# EAGLE design Desain_PCB (Mainboard) (EAGLE 9.6.2)
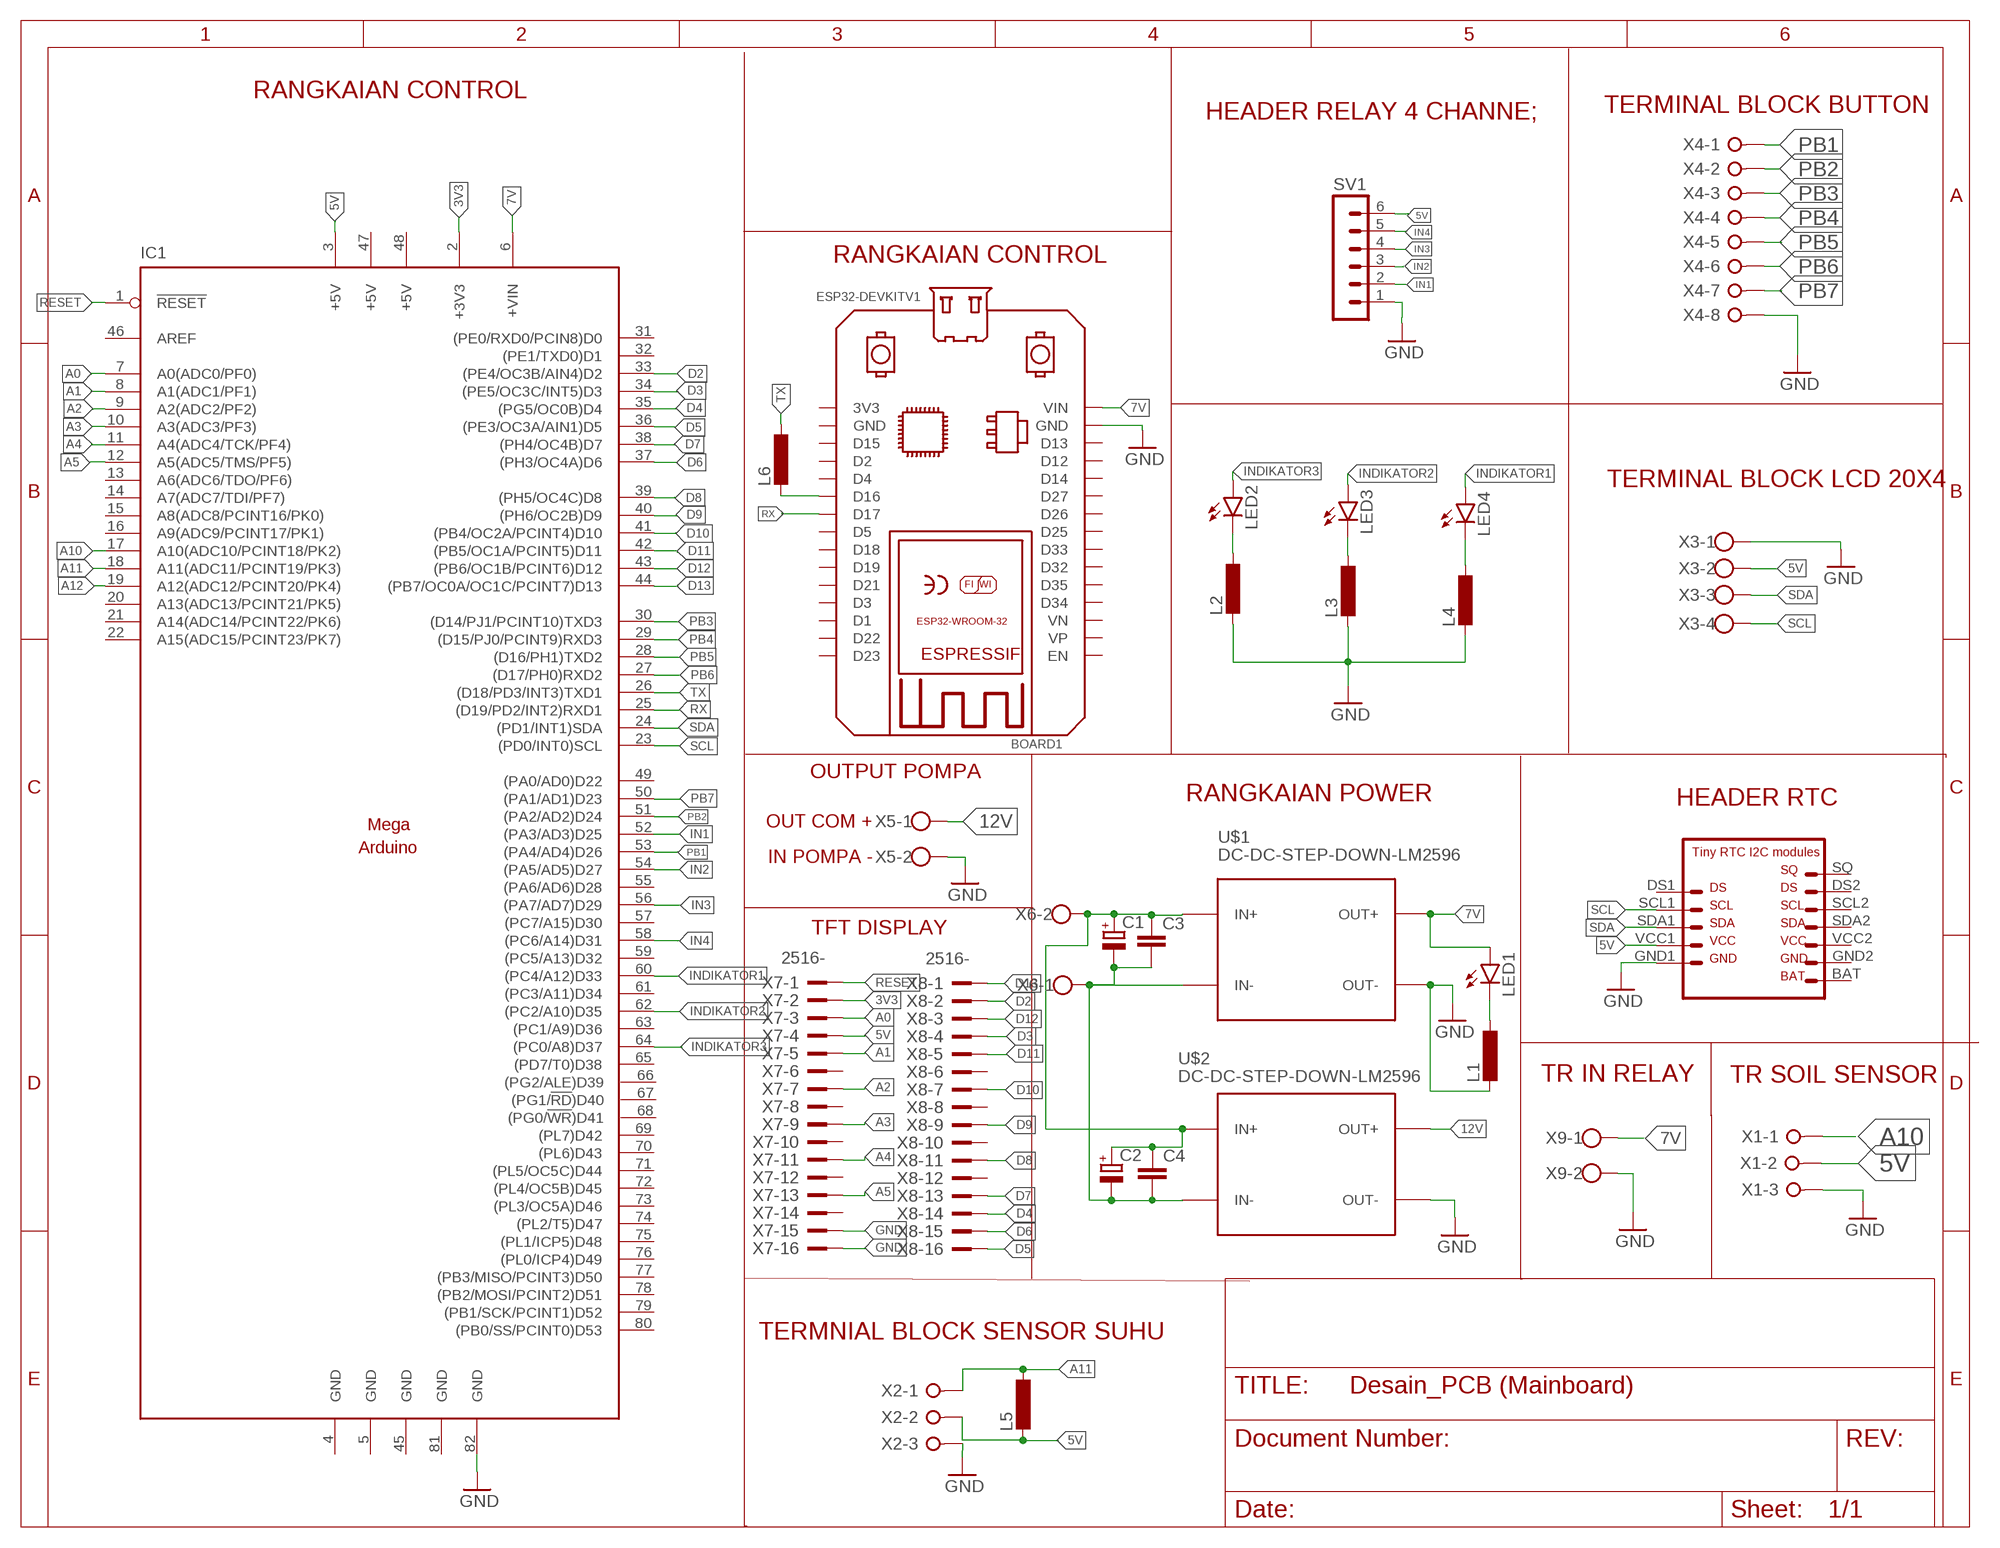
[diagram p0: schematic, sheet 1]

## Parts
BOARD1  ESP32DEVKITV1  [ESP32-DEVKITV1]
C1  CPOL-EUE2,5-6E  [E2,5-6E]
C2  CPOL-EUE2,5-6E  [E2,5-6E]
C3  C-EU025-025X050  [C025-025X050]
C4  C-EU025-025X050  [C025-025X050]
IC1  ARDUINOMEGA  [ARDUINOMEGA]
L1  L-EU0207/10  [0207/10]
L2  L-EU0207/10  [0207/10]
L3  L-EU0207/10  [0207/10]
L4  L-EU0207/10  [0207/10]
L5  L-EU0207/10  [0207/10]
L6  L-EU0207/10  [0207/10]
LED1  LED5MM  [LED5MM]
LED2  LED5MM  [LED5MM]
LED3  LED5MM  [LED5MM]
LED4  LED5MM  [LED5MM]
SV1  MA06-1  [MA06-1]
U$1  DC-DC-STEP-DOWN-LM2596  [DC-DC-STEP-DOWN-LM2596]
U$2  DC-DC-STEP-DOWN-LM2596  [DC-DC-STEP-DOWN-LM2596]
U$3  RTC  [RTC]
X1  W237-3E  [W237-3E]
X2  W237-3E  [W237-3E]
X3  W237-4  [W237-4]
X4  W237-08P  [W237-8P]
X5  W237-102  [W237-102]
X6  W237-102  [W237-102]
X7  2516-  [PAK100/2500-16]
X8  2516-  [PAK100/2500-16]
X9  W237-102  [W237-102]

## Nets
3V3: IC1.2(+3V3) X7.2
5V: IC1.3(+5V) L5.2 SV1.6 U$3.VCC1 X1.2 X2.2 X3.2 X7.4
7V: BOARD1.VIN IC1.6(+VIN) LED1.A U$1.OUT+ X9.1
12V: U$2.OUT+ X5.1
A0: IC1.7(A0(ADC0/PF0)) X7.3
A1: IC1.8(A1(ADC1/PF1)) X7.5
A2: IC1.9(A2(ADC2/PF2)) X7.7
A3: IC1.10(A3(ADC3/PF3)) X7.9
A4: IC1.11(A4(ADC4/TCK/PF4)) X7.11
A5: IC1.12(A5(ADC5/TMS/PF5)) X7.13
A10: IC1.17(A10(ADC10/PCINT18/PK2)) X1.1
A11: IC1.18(A11(ADC11/PCINT19/PK3)) L5.1 X2.1
A12: IC1.19(A12(ADC12/PCINT20/PK4))
D2: IC1.33((PE4/OC3B/AIN4)D2) X8.2
D3: IC1.34((PE5/OC3C/INT5)D3) X8.4
D4: IC1.35((PG5/OC0B)D4) X8.14
D5: IC1.36((PE3/OC3A/AIN1)D5) X8.16
D6: IC1.37((PH3/OC4A)D6) X8.15
D7: IC1.38((PH4/OC4B)D7) X8.13
D8: IC1.39((PH5/OC4C)D8) X8.11
D9: IC1.40((PH6/OC2B)D9) X8.9
D10: IC1.41((PB4/OC2A/PCINT4)D10) X8.7
D11: IC1.42((PB5/OC1A/PCINT5)D11) X8.5
D12: IC1.43((PB6/OC1B/PCINT6)D12) X8.3
D13: IC1.44((PB7/OC0A/OC1C/PCINT7)D13) X8.1
GND: BOARD1.GND IC1.82(GND) L1.2 L2.2 L3.2 L4.2 SV1.1 U$1.OUT- U$2.OUT- U$3.GND1 X1.3 X2.3 X3.1 X4.8 X5.2 X7.15 X7.16 X9.2
IN1: IC1.52((PA3/AD3)D25) SV1.2
IN2: IC1.54((PA5/AD5)D27) SV1.3
IN3: IC1.56((PA7/AD7)D29) SV1.4
IN4: IC1.58((PC6/A14)D31) SV1.5
INDIKATOR1: IC1.60((PC4/A12)D33) LED4.A
INDIKATOR2: IC1.62((PC2/A10)D35) LED3.A
INDIKATOR3: IC1.64((PC0/A8)D37) LED2.A
N$2: C1.- C2.- C3.2 C4.2 U$1.IN- U$2.IN- X6.1
N$3: L1.1 LED1.K(C)
N$4: BOARD1.D16 L6.2
N$6: L2.1 LED2.K(C)
N$8: L3.1 LED3.K(C)
N$10: L4.1 LED4.K(C)
N$79: C1.+ C2.+ C3.1 C4.1 U$1.IN+ U$2.IN+ X6.2
PB1: IC1.53((PA4/AD4)D26) X4.1
PB2: IC1.51((PA2/AD2)D24) X4.2
PB3: IC1.30((D14/PJ1/PCINT10)TXD3) X4.3
PB4: IC1.29((D15/PJ0/PCINT9)RXD3) X4.4
PB5: IC1.28((D16/PH1)TXD2) X4.5
PB6: IC1.27((D17/PH0)RXD2) X4.6
PB7: IC1.50((PA1/AD1)D23) X4.7
RESET: IC1.1(!RESET) X7.1
RX: BOARD1.D17 IC1.25((D19/PD2/INT2)RXD1)
SCL: IC1.23((PD0/INT0)SCL) U$3.SCL1 X3.4
SDA: IC1.24((PD1/INT1)SDA) U$3.SDA1 X3.3
TX: IC1.26((D18/PD3/INT3)TXD1) L6.1
Unconnected: BOARD1.3V3 BOARD1.D1 BOARD1.D2 BOARD1.D3 BOARD1.D4 BOARD1.D5 BOARD1.D12 BOARD1.D13 BOARD1.D14 BOARD1.D15 BOARD1.D18 BOARD1.D19 BOARD1.D21 BOARD1.D22 BOARD1.D23 BOARD1.D25 BOARD1.D26 BOARD1.D27 BOARD1.D32 BOARD1.D33 BOARD1.D34 BOARD1.D35 BOARD1.EN BOARD1.GND@1(GND) BOARD1.VN BOARD1.VP IC1.13(A6(ADC6/TDO/PF6)) IC1.14(A7(ADC7/TDI/PF7)) IC1.15(A8(ADC8/PCINT16/PK0)) IC1.16(A9(ADC9/PCINT17/PK1)) IC1.20(A13(ADC13/PCINT21/PK5)) IC1.21(A14(ADC14/PCINT22/PK6)) IC1.22(A15(ADC15/PCINT23/PK7)) IC1.31((PE0/RXD0/PCIN8)D0) IC1.32((PE1/TXD0)D1) IC1.46(AREF) IC1.49((PA0/AD0)D22) IC1.55((PA6/AD6)D28) IC1.57((PC7/A15)D30) IC1.59((PC5/A13)D32) IC1.61((PC3/A11)D34) IC1.63((PC1/A9)D36) IC1.65((PD7/T0)D38) IC1.66((PG2/ALE)D39) IC1.67((PG1/!RD!)D40) IC1.68((PG0/!WR!)D41) IC1.69((PL7)D42) IC1.70((PL6)D43) IC1.71((PL5/OC5C)D44) IC1.72((PL4/OC5B)D45) IC1.73((PL3/OC5A)D46) IC1.74((PL2/T5)D47) IC1.75((PL1/ICP5)D48) IC1.76((PL0/ICP4)D49) IC1.77((PB3/MISO/PCINT3)D50) IC1.78((PB2/MOSI/PCINT2)D51) IC1.79((PB1/SCK/PCINT1)D52) IC1.80((PB0/SS/PCINT0)D53) U$3.BAT U$3.DS1 U$3.DS2 U$3.GND2 U$3.SCL2 U$3.SDA2 U$3.SQ U$3.VCC2 X7.6 X7.8 X7.10 X7.12 X7.14 X8.6 X8.8 X8.10 X8.12

## Notes on the sheet
- RANGKAIAN CONTROL
- HEADER RELAY 4 CHANNE; | TERMINAL BLOCK BUTTON
- RANGKAIAN CONTROL
- TERMINAL BLOCK LCD 20X4
- OUTPUT POMPA
- RANGKAIAN POWER | HEADER RTC
- OUT COM +
- IN POMPA -
- TFT DISPLAY
- TR IN RELAY | TR SOIL SENSOR
- TERMNIAL BLOCK SENSOR SUHU

## Power pins joined to a net without a drawn wire
+5V: IC1.47(+5V) IC1.48(+5V)
GND: IC1.4(GND) IC1.5(GND) IC1.45(GND) IC1.81(GND)

## Library data of the parts
BOARD1 = ESP32-DEVKITV1:ESP32DEVKITV1: https://github.com/shridattdudhat
C1 C2 = CAPACITOR:CPOL-EU: POLARIZED CAPACITOR, European symbol; SPICEPREFIX: C
C3 C4 = CAPACITOR:C-EU: CAPACITOR, European symbol; SPICEPREFIX: C
IC1 = microcontroller:ARDUINOMEGA: The Arduino Mega is a microcontroller board based on the ATmega1280. - 54 digital input/output pins (of which 14 can be used as PWM outputs) - 16 analog inputs - 4 UARTs (hardware serial ports) - 16 MHz crystal oscillator - USB connection - power jack - ICSP header - reset button It contains everything needed to support the microcontroller; simply connect it to a computer with a USB cable or power it with a AC-to-DC adapter or battery to get started. The Mega is compatible with most shields designed for the Arduino Duemilanove or Diecimila. http://arduino.cc/en/Main/ArduinoBoardMega
L1-L6 = rcl:L-EU: INDUCTOR, European symbol; SPICEPREFIX: L
LED1-LED4 = led:LED: LED OSRAM: - CHIPLED LG R971, LG N971, LY N971, LG Q971, LY Q971, LO R971, LY R971 LH N974, LH R974 LS Q976, LO Q976, LY Q976 LO Q996 - Hyper CHIPLED LW Q18S LB Q993, LB Q99A, LB R99A - SideLED LS A670, LO A670, LY A670, LG A670, LP A670 LB A673, LV A673, LT A673, LW A673 LH A674 LY A675 LS A676, LA A676, LO A676, LY A676, LW A676 LS A679, LY A679, LG A679 - Hyper Micro SIDELED® LS Y876, LA Y876, LO Y876, LY Y876 LT Y87S - SmartLED LW L88C, LW L88S LB L89C, LB L89S, LG L890 LS L89K, LO L89K, LY L89K LS L896, LA L896, LO L896, LY L896 - TOPLED LS T670, LO T670, LY T670, LG T670, LP T670 LSG T670, LSP T670, LSY T670, LOP T670, LYG T670 LG T671, LOG T671, LSG T671 LB T673, LV T673, LT T673, LW T673 LH T674 LS T676, LA T676, LO T676, LY T676, LB T676, LH T676, LSB T676, LW T676 LB T67C, LV T67C, LT T67C, LS T67K, LO T67K, LY T67K, LW E67C LS E67B, LA E67B, LO E67B, LY E67B, LB E67C, LV E67C, LT E67C LW T67C LS T679, LY T679, LG T679 LS T770, LO T770, LY T770, LG T770, LP T770 LB T773, LV T773, LT T773, LW T773 LH T774 LS E675, LA E675, LY E675, LS T675 LS T776, LA T776, LO T776, LY T776, LB T776 LHGB T686 LT T68C, LB T68C - Hyper Mini TOPLED® LB M676 - Mini TOPLED Santana® LG M470 LS M47K, LO M47K, LY M47K Source: http://www.osram.convergy.de LUXEON: - LUMILED® LXK2-PW12-R00, LXK2-PW12-S00, LXK2-PW14-U00, LXK2-PW14-V00 LXK2-PM12-R00, LXK2-PM12-S00, LXK2-PM14-U00 LXK2-PE12-Q00, LXK2-PE12-R00, LXK2-PE12-S00, LXK2-PE14-T00, LXK2-PE14-U00 LXK2-PB12-K00, LXK2-PB12-L00, LXK2-PB12-M00, LXK2-PB14-N00, LXK2-PB14-P00, LXK2-PB14-Q00 LXK2-PR12-L00, LXK2-PR12-M00, LXK2-PR14-Q00, LXK2-PR14-R00 LXK2-PD12-Q00, LXK2-PD12-R00, LXK2-PD12-S00 LXK2-PH12-R00, LXK2-PH12-S00 LXK2-PL12-P00, LXK2-PL12-Q00, LXK2-PL12-R00 Source: www.luxeon.com KINGBRIGHT: KA-3528ASYC Source: www.kingbright.com
SV1 = con-lstb:MA06-1: PIN HEADER; OC_FARNELL: unknown; OC_NEWARK: unknown
U$1 U$2 = diy-modules:DC-DC-STEP-DOWN-LM2596: DC/DC Step-Down Regulator based on LM2596-ADJ chip
U$3 = RTC:RTC
X1 X2 = con-wago-508:W237-3E: WAGO SREW CLAMP; OC_FARNELL: unknown; OC_NEWARK: unknown
X3 = con-wago-500:W237-4: WAGO SCREW CLAMP; OC_FARNELL: unknown; OC_NEWARK: unknown
X4 = con-wago-508:W237-08P: WAGO SREW CLAMP; OC_FARNELL: unknown; OC_NEWARK: unknown
X5 X6 X9 = con-wago-500:W237-102: WAGO SCREW CLAMP; MPN: 237-102; OC_FARNELL: unknown; OC_NEWARK: 70K9898
X7 X8 = con-3m:2516-: 3M (TM) Pak 100 4-Wall Header Source: 3M; OC_FARNELL: unknown; OC_NEWARK: unknown

## Board
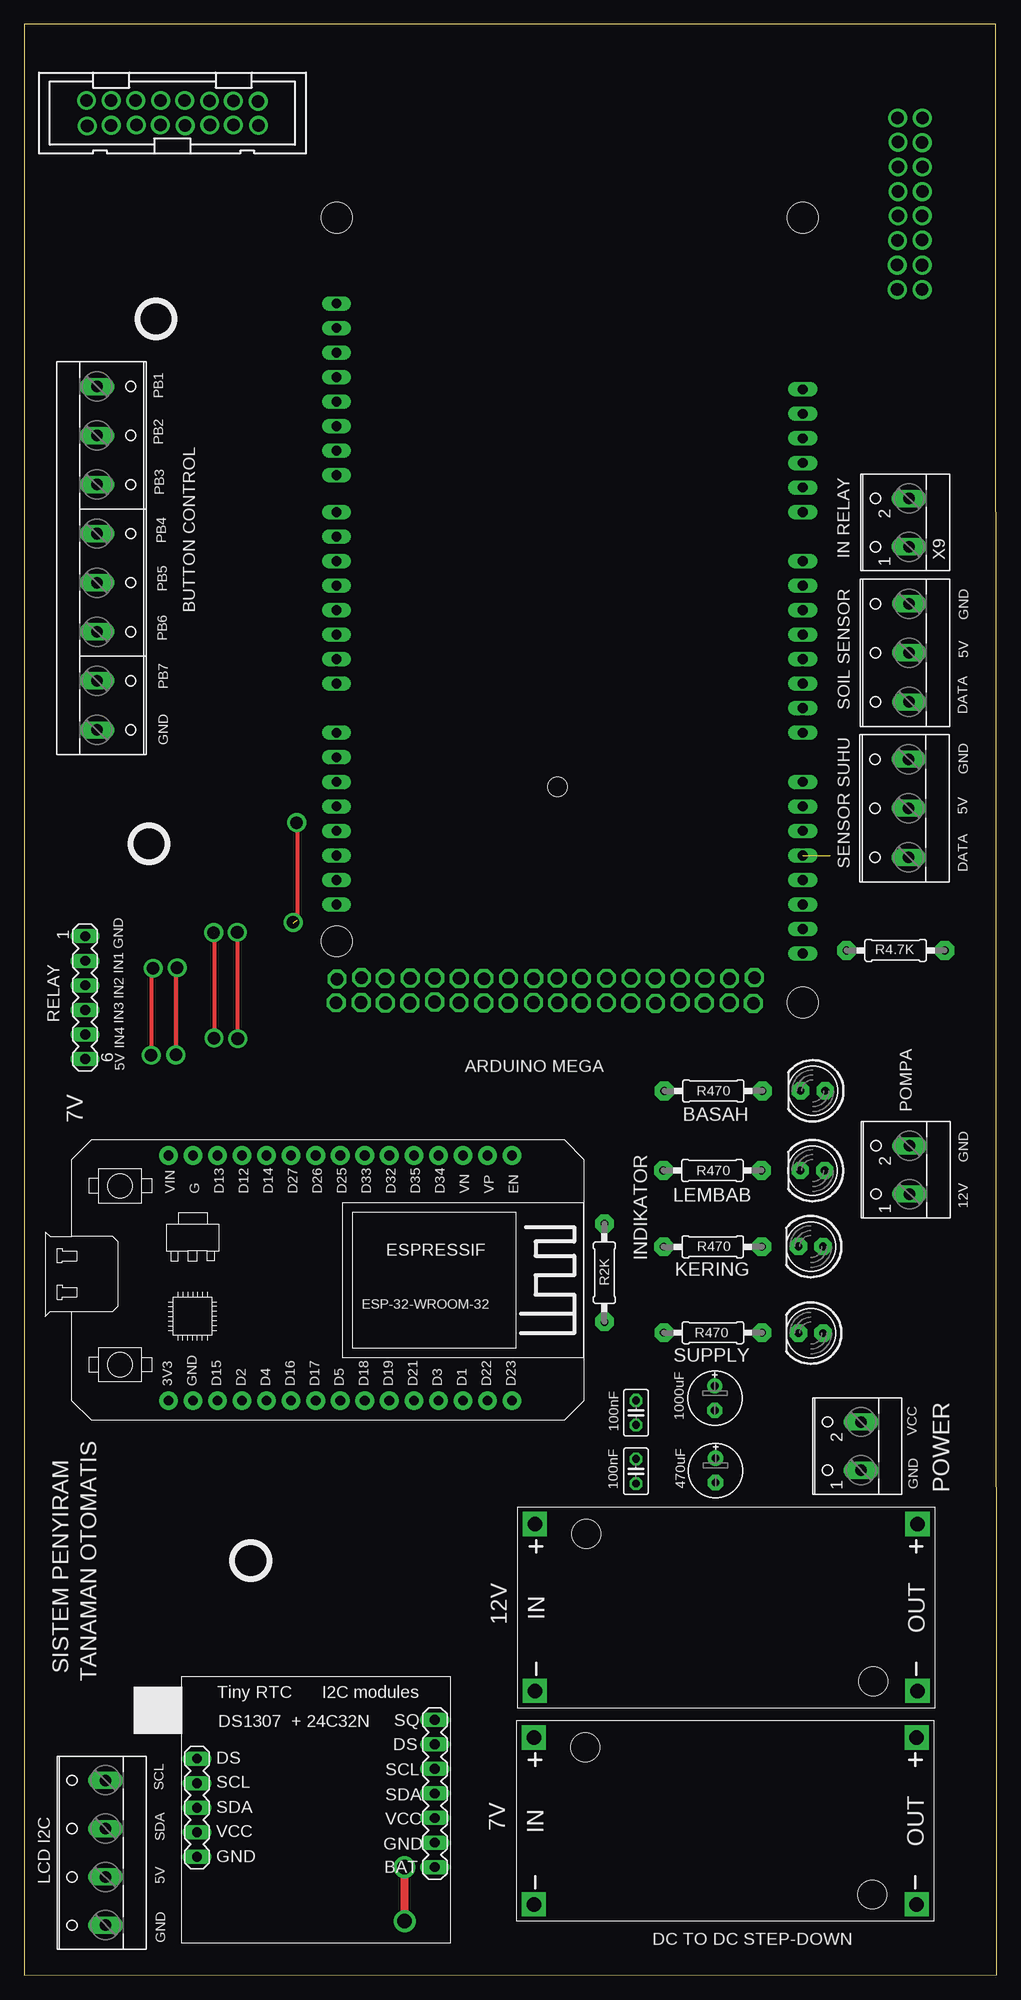
[diagram p1: board, top side]
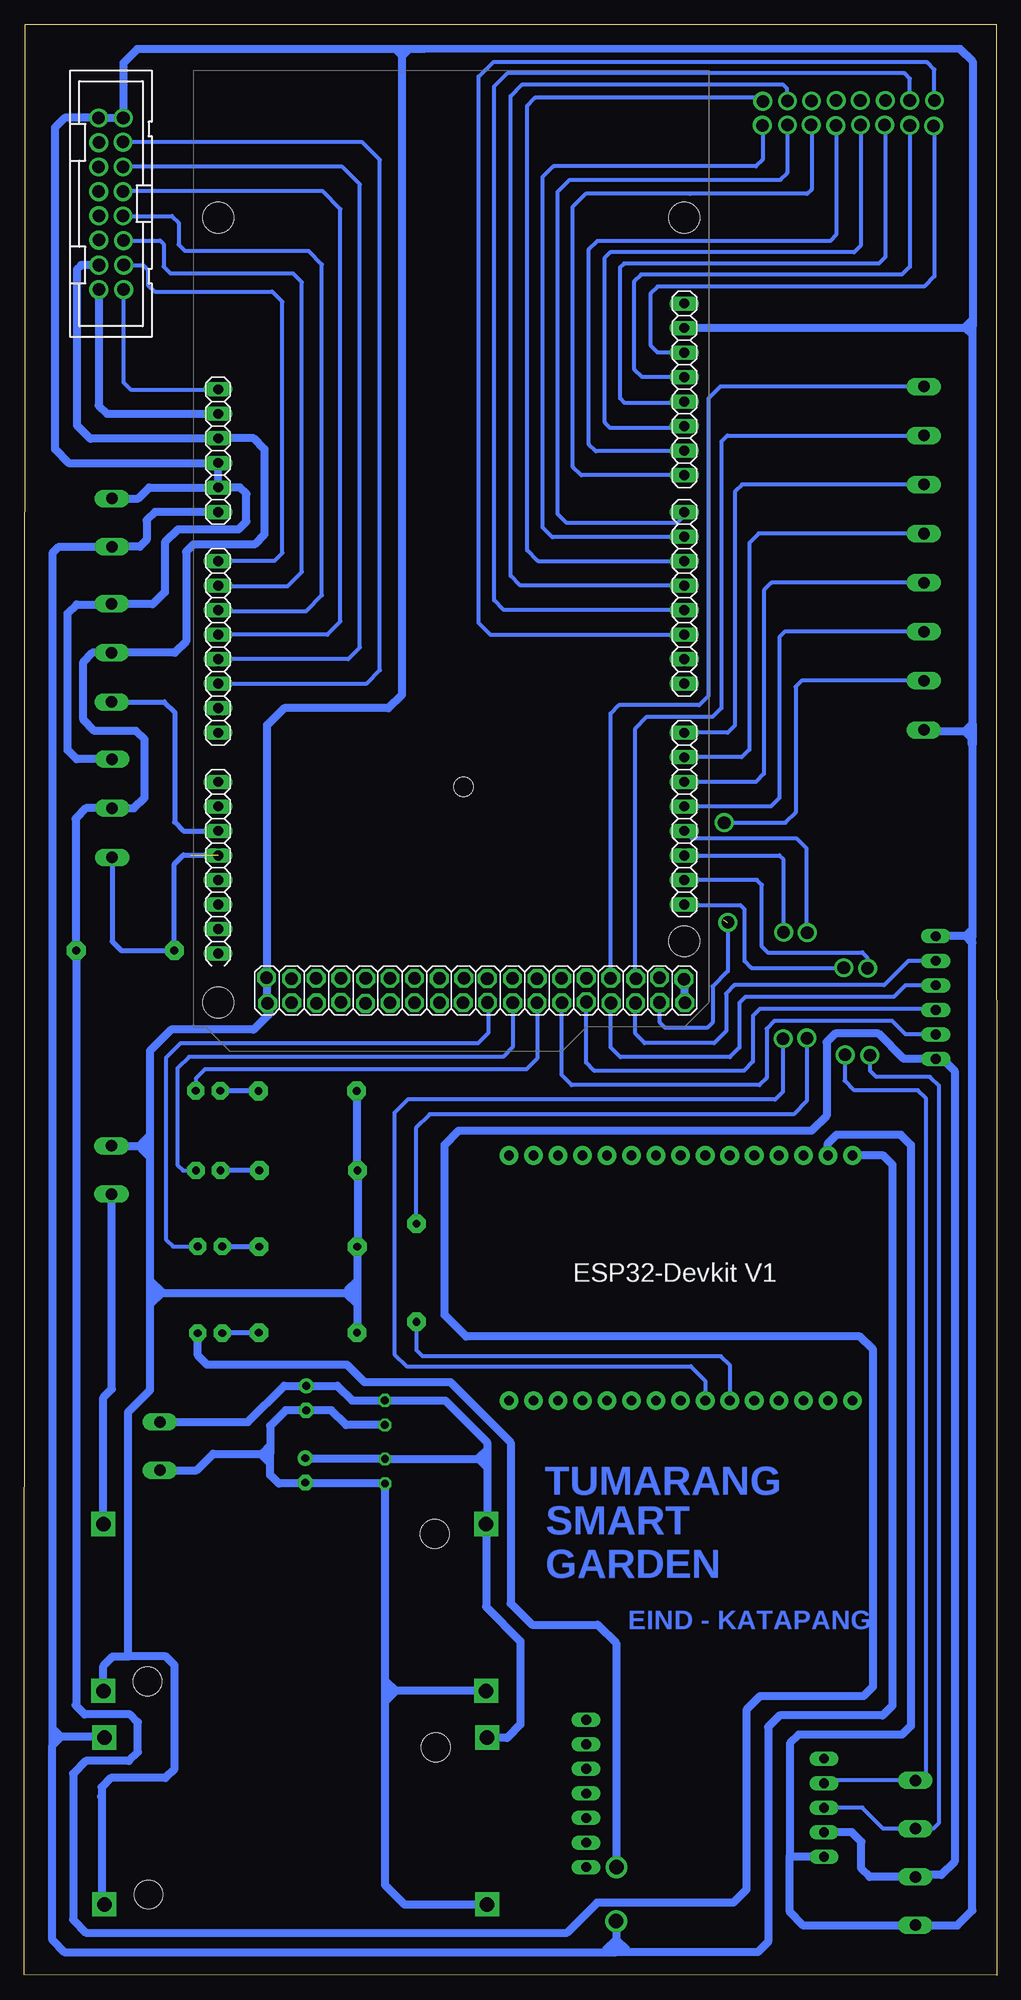
[diagram p2: board, bottom side, seen from below]

Size 100.68 x 202.03 mm. Coordinates in mm from the lower left corner, seen from the top.
Outline: 0,0 100.68,0.06 100.59,202.03 0.03,202.02 0,0
Copper layers (1*16): Top 0.035mm / dielectric 1.5mm / Bottom 0.035mm
Design rules "default *": minimum track width 6mil, minimum drill 0.35mm, track to track 16mil, track to pad 16mil, pad to pad 16mil, via to via 16mil, smd to smd 6mil, copper to edge 24mil, drill to drill 6mil, minimum pad ring 10mil, minimum via ring 8mil, stop-mask expansion 4mil, vias tented up to drill 0mil, thermal gap 10mil

### Footprints (pad centres in the part's own frame; a part is rotated, then mirrored left to right if it is on the bottom)
ESP32-DEVKITV1 = drill 1 pad 1.93: 3V3 0,0; D1 30.48,0; D2 7.62,0; D3 27.94,0; D4 10.16,0; D5 17.78,0; D12 7.62,25.4; D13 5.08,25.4; D14 10.16,25.4; D15 5.08,0; D16 12.7,0; D17 15.24,0; D18 20.32,0; D19 22.86,0; D21 25.4,0; D22 33.02,0; D23 35.56,0; D25 17.78,25.4; D26 15.24,25.4; D27 12.7,25.4; D32 22.86,25.4; D33 20.32,25.4; D34 27.94,25.4; D35 25.4,25.4; EN 35.56,25.4; GND 2.54,25.4; GND@1 2.54,0; VIN 0,25.4; VN 30.48,25.4; VP 33.02,25.4
E2,5-6E = drill 0.813 pad 1.575: + -1.27,0 | drill 0.813 pad 1.575 octagon: - 1.27,0
C025-025X050 = drill 0.813 octagon: 1 -1.27,0; 2 1.27,0
ARDUINOMEGA = drill 1.016 long: 1 33.02,2.54; 2 35.56,2.54; 3 38.1,2.54; 4 40.64,2.54; 5 43.18,2.54; 6 45.72,2.54; 7 50.8,2.54; 8 53.34,2.54; 9 55.88,2.54; 10 58.42,2.54; 11 60.96,2.54; 12 63.5,2.54; 13 66.04,2.54; 14 68.58,2.54; 15 73.66,2.54; 16 76.2,2.54; 17 78.74,2.54; 18 81.28,2.54; 19 83.82,2.54; 20 86.36,2.54; 21 88.9,2.54; 22 91.44,2.54; 23 86.36,50.8; 24 83.82,50.8; 25 81.28,50.8; 26 78.74,50.8; 27 76.2,50.8; 28 73.66,50.8; 29 71.12,50.8; 30 68.58,50.8; 31 63.5,50.8; 32 60.96,50.8; 33 58.42,50.8; 34 55.88,50.8; 35 53.34,50.8; 36 50.8,50.8; 37 48.26,50.8; 38 45.72,50.8; 39 41.91,50.8; 40 39.37,50.8; 41 36.83,50.8; 42 34.29,50.8; 43 31.75,50.8; 44 29.21,50.8; 45 26.67,50.8; 46 24.13,50.8 | drill 1.016 octagon: 47 93.98,50.8; 48 96.52,50.8; 49 93.98,48.26; 50 96.52,48.26; 51 93.98,45.72; 52 96.52,45.72; 53 93.98,43.18; 54 96.52,43.18; 55 93.98,40.64; 56 96.52,40.64; 57 93.98,38.1; 58 96.52,38.1; 59 93.98,35.56; 60 96.52,35.56; 61 93.98,33.02; 62 96.52,33.02; 63 93.98,30.48; 64 96.52,30.48; 65 93.98,27.94; 66 96.52,27.94; 67 93.98,25.4; 68 96.52,25.4; 69 93.98,22.86; 70 96.52,22.86; 71 93.98,20.32; 72 96.52,20.32; 73 93.98,17.78; 74 96.52,17.78; 75 93.98,15.24; 76 96.52,15.24; 77 93.98,12.7; 78 96.52,12.7; 79 93.98,10.16; 80 96.52,10.16; 81 93.98,7.62; 82 96.52,7.62 | hole 3.2: 15.24,50.8; 15.24,2.54; 90.17,50.8; 96.52,2.54 | hole 2: 74.168,27.94
0207/10 = drill 0.813 pad 1.93 octagon: 1 -5.08,0; 2 5.08,0
LED5MM = drill 0.813 pad 1.778 octagon: A -1.27,0; K 1.27,0
MA06-1 = drill 1.016 long: 1 -6.35,0; 2 -3.81,0; 3 -1.27,0; 4 1.27,0; 5 3.81,0; 6 6.35,0
DC-DC-STEP-DOWN-LM2596 = drill 1.5 pad 2.5 square: IN+ -19.812,8.636; IN- -19.812,-8.636; OUT+ 19.812,8.636; OUT- 19.812,-8.636 | hole 3: -14.478,7.62; 15.24,-7.62
RTC = drill 1.016 long: BAT 25.75,7.82; DS1 1.13,19.05; DS2 25.75,20.52; GND1 1.13,8.89; GND2 25.75,10.36; SCL1 1.13,16.51; SCL2 25.75,17.98; SDA1 1.13,13.97; SDA2 25.75,15.44; SQ 25.75,23.06; VCC1 1.13,11.43; VCC2 25.75,12.9
W237-3E = drill 1.194 long: 1 -5.08,-0.635; 2 0,-0.635; 3 5.08,-0.635
W237-4 = drill 1.194 long: 1 -7.5,-1.27; 2 -2.5,-1.27; 3 2.5,-1.27; 4 7.5,-1.27
W237-8P = drill 1.194 long: 1 -17.78,-0.635; 2 -12.7,-0.635; 3 -7.62,-0.635; 4 -2.54,-0.635; 5 2.54,-0.635; 6 7.62,-0.635; 7 12.7,-0.635; 8 17.78,-0.635
W237-102 = drill 1.194 long: 1 -2.5,-1.27; 2 2.5,-1.27
PAK100/2500-16 = drill 1 pad 1.422: 1 -8.89,-1.27; 2 -8.89,1.27; 3 -6.35,-1.27; 4 -6.35,1.27; 5 -3.81,-1.27; 6 -3.81,1.27; 7 -1.27,-1.27; 8 -1.27,1.27; 9 1.27,-1.27; 10 1.27,1.27; 11 3.81,-1.27; 12 3.81,1.27; 13 6.35,-1.27; 14 6.35,1.27; 15 8.89,-1.27; 16 8.89,1.27

### Placement (x,y rotation side)
BOARD1  14.94,59.49 0 top
C1  71.57,52.28 270 top
C2  71.49,59.77 270 top
C3  63.34,58.25 270 top
C4  63.33,52.19 270 top
IC1  83.14,197.24 270 bottom
L1  71.3,66.54 180 top
L2  71.28,75.44 180 top
L3  71.25,83.34 180 top
L4  71.34,91.57 180 top
L5  90.21,106.12 0 top
L6  60.07,72.75 270 top
LED1  81.43,66.5 180 top
LED2  81.43,75.46 180 top
LED3  81.62,83.33 180 top
LED4  81.64,91.59 180 top
SV1  6.31,101.24 270 top
U$1  72.57,15.99 0 top
U$2  72.67,38.08 0 top
U$3  16.76,3.39 0 top
X1  90.98,136.94 90 top
X2  90.93,120.84 90 top
X3  7.16,12.69 90 top
X4  8.19,146.74 270 top
X5  90.38,83.4 90 top
X6  85.37,54.8 90 top
X7  91.69,183.44 90 bottom
X8  15.35,192.82 0 top
X9  90.33,150.42 90 top

### Tracks (layer width: path | path; a pad name or v marks a point on that pad's centre or on a via)
3V3
  Bottom 0.813: X7.2 92.96,162.54 92.1,161.68 IC1.2
5V
  Bottom 0.813: X7.4 94.77,177.09 95.21,176.65 95.21,160.5 93.82,159.11 80.63,159.11 IC1.3 76.92,159.14 75.81,158.03 75.81,149.18 76.83,148.16 83.16,148.16 83.91,147.41 83.91,138.11 85.08,136.94 X1.2 93.61,136.94 94.56,135.99 94.56,130.01 93.41,128.86 89.12,128.86 88.22,127.96 88.22,121.94 89.32,120.84 X2.2 94.29,120.84 95.36,119.77 95.36,106.19 L5.2 95.29,28.03 95.36,27.96 94.41,27.01 89.71,27.01 88.91,26.21 88.91,23.11 89.83,22.19 94.29,22.19 95.61,20.87 95.61,5.76 94.28,4.43 44.48,4.43 41.37,7.54 27.27,7.54 25.93,8.88 25.93,27.49 24.51,28.91 13.81,28.91 12.81,29.91 12.81,64.79 14.17,66.15 54.93,66.15 57.16,68.38 57.16,85.99 55.72,87.43 19.18,87.43 17.61,89 17.61,96.62 16.72,97.51 12.23,97.51 9.62,94.89 SV1.6 5.61,94.89 4.36,93.64 4.36,11.77 5.74,10.39 8.23,10.39 X3.2 13.17,10.19 14.02,11.04 14.02,13.83 15.01,14.82 U$3.VCC1
7V  (via drill 1.5)
  Top 0.813: v39.36,11.2 39.36,5.61 v39.39,5.61
  Bottom 0.813: 80.7,151.42 IC1.6 87.13,151.52 87.99,150.66 87.99,148.64 88.71,147.92 X9.1 97.09,147.92 97.77,147.24 97.77,25.56 | BOARD1.VIN 11.75,84.89 10.81,83.95 10.81,27.91 11.81,26.91 22.49,26.91 23.68,25.72 23.68,3.46 24.73,2.41 38.31,2.41 | 38.31,2.41 39.39,2.41 | 97.77,25.56 97.77,23.84 | v39.39,5.61 39.39,3.71 | 39.39,2.41 39.39,3.71 | 40.51,2.41 96.51,2.41 97.77,3.67 97.77,23.84 | 40.51,2.41 39.39,2.41 | LED1.A 82.7,64.2 81.73,63.23 67.26,63.23 65.45,61.42 56.56,61.42 50.31,55.17 50.31,38.51 48.11,36.31 41.31,36.31 39.41,34.41 39.41,11.25 v39.36,11.2 | 97.77,25.56 96.91,24.7 | 96.91,24.7 97.77,23.84 | U$1.OUT+ 92.45,24.7 96.91,24.7 | 39.39,3.71 38.31,2.63 38.31,2.41 | 39.39,3.71 40.51,2.59 40.51,2.41
12V
  Bottom 0.813: 92.59,47.25 92.48,47.14 U$2.OUT+ 92.48,59.84 91.61,60.71 91.61,80.86 X5.1
+5V
  Bottom 0.813: IC1.47 IC1.48
A0
  Bottom 0.406: IC1.7 74.78,146.44 73.94,147.28 73.94,173.27 75,174.33 87.18,174.33 87.87,175.02 87.87,176.6 88.36,177.09 X7.3
A1
  Bottom 0.406: IC1.8 80.51,143.81 73.43,143.81 71.94,145.3 71.94,175.31 72.87,176.24 85.54,176.24 86.24,176.94 86.24,179.26 86.61,179.63 X7.5
A2
  Bottom 0.406: IC1.9 80.45,141.21 71.53,141.21 69.85,142.89 69.85,177.15 71.27,178.57 84.04,178.57 84.68,179.21 84.68,181.45 85.4,182.17 X7.7
A3
  Bottom 0.406: IC1.10 69.3,138.82 67.94,140.18 67.94,182.89 69.76,184.71 X7.9
A4
  Bottom 0.406: IC1.11 67.14,136.28 65.92,137.5 65.92,185.44 67.73,187.25 X7.11
A5
  Bottom 0.406: IC1.12 80.57,133.71 65.28,133.71 63.86,135.13 63.86,187.99 65.66,189.79 X7.13
A10
  Bottom 0.508: X1.1 86.16,131.86 85.11,130.81 85.11,119.41 84.2,118.5 IC1.17
A11  (1 unrouted)
  Bottom 0.406: 91.48,115.67 X2.1 | 83.5,115.97 83.42,115.97
  Bottom 0.508: X2.1 91.57,107.06 90.61,106.11 L5.1 85.13,115.09 84.21,116.01 80.65,116.01 IC1.18
D2
  Bottom 0.406: X8.2 6.46,197.33 7.21,198.08 52.14,198.08 53.63,196.59 53.63,140.04 52.41,138.82 IC1.33
D3
  Bottom 0.406: X8.4 9,196.4 9.53,196.93 50.69,196.93 52.03,195.59 52.03,142.38 51.01,141.36 IC1.34
D4
  Bottom 0.406: IC1.35 49.31,143.9 50.33,144.92 50.33,194.59 49.17,195.75 22.09,195.75 21.7,195.36 X8.14
D5
  Bottom 0.406: IC1.36 47.51,146.44 48.62,147.55 48.62,193.58 47.81,194.39 24.54,194.39 X8.16
D6
  Bottom 0.406: X8.15 24.24,188.01 24.94,187.31 45.91,187.31 47.01,186.21 47.01,149.91 46.01,148.91 32.41,148.91 IC1.37
D7
  Bottom 0.406: IC1.38 32.34,151.15 33.11,150.38 44.52,150.38 45.46,151.32 45.46,184.66 44.21,185.91 22.4,185.91 21.7,186.61 X8.13
D8
  Bottom 0.406: X8.11 19.16,184.91 19.62,184.45 31.75,184.45 42.57,184.45 43.87,183.15 43.87,156.17 43.01,155.31 32.36,155.31 IC1.39
D9
  Bottom 0.406: X8.9 16.62,180.21 17.25,179.58 41.34,179.58 42.21,178.71 42.21,158.51 41.51,157.81 32.4,157.81 IC1.40
D10
  Bottom 0.406: X8.7 14.08,179.09 14.76,178.41 40.01,178.41 40.57,177.85 40.57,160.77 40.01,160.21 32.54,160.21 IC1.41
D11
  Bottom 0.406: X8.5 11.54,177.91 12.21,177.24 38.58,177.24 38.98,176.84 38.98,163.28 38.51,162.81 32.48,162.81 IC1.42
D12
  Bottom 0.406: X8.3 9,176.91 9.82,176.09 36.82,176.09 37.5,175.41 37.5,166.28 36.71,165.49 IC1.43
D13
  Bottom 0.406: X8.1 6.46,175.91 7.52,174.85 35.11,174.85 35.81,174.15 35.81,168.73 35.11,168.03 IC1.44
GND  (via drill 0.85 pad 1.5)
  Bottom 0.152: 2.51,127.37 2.52,127.38 2.57,127.43
  Bottom 0.813: IC1.5 IC1.4 96.07,156.6 97.48,158.01 97.48,191.35 96.5,192.33 X7.16 X7.15 90.42,198 88.98,199.44 62.21,199.44 | X2.3 95.24,125.92 96.17,126.85 96.17,141.04 95.26,141.95 91.69,141.95 X1.3 91.56,141.96 87.37,141.96 86.11,143.22 86.11,148.38 84.78,149.72 78.51,149.72 77.68,150.54 77.68,153.4 78.34,154.06 IC1.5 | U$2.OUT- 92.48,32.04 91.51,33.01 89.91,33.01 | 66.17,91.48 L4.2 66.26,83.43 L3.2 66.17,75.47 L2.2 66.2,71.91 | BOARD1.GND 17.48,86.14 16.6,87.02 9.92,87.02 8.89,85.99 8.89,25.83 9.81,24.91 20.51,24.91 21.41,24.01 21.41,12.41 | 2.57,127.43 2.57,128.1 | 2.57,128.1 2.57,128.84 3.28,128.84 | 2.51,129.61 2.51,127.37 | 2.51,129.61 2.51,169.81 | 2.51,169.81 2.51,170.73 | X4.8 7.44,128.84 3.31,128.84 | U$3.GND1 21.28,12.28 21.41,12.41 | 60,199.45 60.89,199.45 60.89,199.44 | 60,199.45 59.31,199.45 3.82,199.48 2.51,198.17 2.51,171.41 | 21.41,12.41 21.41,6.56 20.01,5.16 8.46,5.16 X3.1 4.07,5.18 2.53,6.72 2.53,106.91 | 92.66,18.56 92.71,18.51 | 89.91,33.01 86.01,33.01 85.11,32.11 85.11,21.41 86.07,20.45 91.69,20.45 92.66,19.48 92.66,18.56 | 92.66,18.56 92.66,7.63 U$1.OUT- | 2.53,107.59 3.21,107.59 | 3.21,107.59 SV1.1 | 2.53,106.91 2.53,107.59 | 2.51,171.41 2.51,170.73 | 60,199.44 60,199.45 | X9.2 88.89,152.92 87.75,154.06 IC1.5 | 89.91,33.01 89.91,58.33 87.63,60.61 87.63,69.51 | 87.63,69.51 87.63,71.01 | 87.63,71.01 87.63,71.91 | 87.63,71.91 87.63,84.71 | 87.63,84.71 87.63,86.11 | 87.63,86.11 87.63,87.01 | 87.63,87.01 87.63,95.76 85.47,97.92 76.93,97.92 75.31,99.55 75.31,100.51 v75.51,100.71 IC1.82 IC1.81 75.52,129.46 73.78,131.2 62.97,131.2 61.56,132.61 61.56,198.78 | X5.2 88.51,85.9
  Bottom 0.813: 88.51,85.9 87.84,85.9 87.63,86.11 | 87.63,87.01 88.51,86.13 88.51,85.9 | 87.63,84.71 88.51,85.59 88.51,85.9 | 66.2,71.91 66.2,70.61 | 66.2,70.61 66.2,69.51 | 66.2,69.51 66.2,66.56 L1.2 | 66.2,70.61 67.21,70.61 | 67.21,70.61 86.51,70.61 | 86.51,70.61 87.23,70.61 87.63,71.01 | 66.2,71.91 67.21,70.9 67.21,70.61 | 66.2,69.51 67.21,70.52 67.21,70.61 | 87.63,71.91 86.51,70.79 86.51,70.61 | 86.51,70.61 87.61,69.51 87.63,69.51 | 3.21,107.59 2.52,108.28 | 2.52,127.38 2.52,108.28 | 2.52,108.28 2.52,107.6 2.53,107.59 | 2.53,106.91 3.21,107.59 | 2.51,129.61 3.28,128.84 | 3.28,128.84 3.31,128.84 | 2.57,128.1 3.31,128.84 | 2.51,170.73 2.67,170.57 3.27,170.57 | 3.35,170.57 IC1.45 | 2.51,171.41 3.35,170.57 | 2.51,169.81 3.27,170.57 | 3.27,170.57 3.35,170.57 | 60.89,199.44 62.21,199.44 | 60.89,199.44 61.56,198.78 | 62.21,199.44 62.21,199.43 61.56,198.78
IN1
  Bottom 0.406: SV1.2 9.14,105.05 11.67,102.52 27.15,102.52 28.01,101.66 28.01,97.77 29.25,96.53 36.44,96.53 37.42,97.51 IC1.52
IN2
  Bottom 0.406: SV1.3 9.47,102.51 10.67,101.31 26.01,101.31 26.64,100.68 26.64,96.06 27.62,95.08 38.95,95.08 39.96,96.09 IC1.54
IN3  (via drill 0.85 pad 1.5)
  Bottom 0.406: SV1.4 6.41,100.07 24.51,100.07 25.24,99.34 25.24,94.6 26.19,93.65 41.66,93.65 42.51,94.5 v42.51,100.71 IC1.56
IN4
  Bottom 0.406: SV1.5 9.44,97.43 10.84,98.83 23.01,98.83 23.83,98.01 23.83,92.94 24.58,92.19 44,92.19 45.04,93.23 IC1.58
INDIKATOR1
  Bottom 0.406: IC1.60 47.58,94.91 48.68,93.81 81.97,93.81 82.9,92.88 LED4.A
INDIKATOR2
  Bottom 0.406: IC1.62 50.12,96.1 51.11,95.11 83.61,95.11 84.81,93.91 84.81,83.91 84.23,83.33 LED3.A
INDIKATOR3
  Bottom 0.406: IC1.64 52.66,97.56 53.71,96.51 84.51,96.51 86.01,95.01 86.01,76.21 85.26,75.46 LED2.A
N$2
  Bottom 0.813: C3.2 67.36,56.98 68.88,58.5 C2.- 73.62,58.5 75.21,56.91 75.21,54.91 | 71.48,50.92 C4.2 63.33,30.56 | 71.48,50.92 C1.- | U$1.IN- 61.31,7.35 63.33,9.37 63.33,28.41 | 75.21,54.91 75.21,54.01 | 71.48,50.92 74.32,50.92 75.21,51.81 75.21,53.01 | 75.21,53.01 75.21,54.01 | X6.1 82.82,52.3 81.11,54.01 76.11,54.01 | 76.11,54.01 75.21,54.01 | 75.21,54.91 76.11,54.01 | 75.21,53.01 76.11,53.91 76.11,54.01 | 63.33,30.56 63.33,29.41 | 63.33,29.41 63.33,28.41 | 63.33,29.41 63.3,29.44 62.21,29.44 | U$2.IN- 62.21,29.44 | 63.33,30.56 62.21,29.44 | 62.21,29.44 63.24,28.41 63.33,28.41
N$3
  Bottom 0.508: L1.1 80.12,66.54 LED1.K
N$4
  Bottom 0.406: BOARD1.D16 27.61,59.52 27.61,63.15 28.55,64.09 59.42,64.09 60.07,64.74 L6.2
N$6
  Bottom 0.406: 76.64,75.16 L2.1 | 80.14,75.44 LED2.K
  Bottom 0.508: L2.1 80.14,75.44
N$7  (via drill 0.85 pad 1.5)
  other vias: 32.31,103.21
N$8
  Bottom 0.406: LED3.K
  Bottom 0.508: L3.1 LED3.K
N$9  (via drill 0.85 pad 1.5)
  other vias: 32.31,100.71
N$10
  Bottom 0.406: 80.35,91.57 LED4.K
  Bottom 0.508: L4.1 80.35,91.57
N$11  (via drill 0.85 pad 1.5)
  other vias: 34.91,103.31
N$12  (via drill 0.85 pad 1.5)
  other vias: 34.91,100.71
N$13  (via drill 0.85 pad 1.5)
  other vias: 37.41,103.21
N$14  (via drill 0.85 pad 1.5)
  other vias: 37.41,100.71
N$15  (via drill 0.85 pad 1.5)
  other vias: 39.91,100.71
N$16  (via drill 0.85 pad 1.5)
  other vias: 40.01,103.21
N$17  (via drill 0.85 pad 1.5)
  other vias: 42.51,103.31
N$18  (via drill 0.85 pad 1.5)
  other vias: 42.51,100.81
N$19  (via drill 0.85 pad 1.5)
  other vias: 45.01,103.21
N$20  (via drill 1.3 pad 1.5)
  other vias: 45.02,100.71
N$21  (via drill 0.85 pad 1.5)
  other vias: 47.61,103.21
N$22  (via drill 0.85 pad 1.5)
  other vias: 47.61,100.71
N$23  (via drill 0.85 pad 1.5)
  other vias: 50.11,103.21
N$24  (via drill 0.85 pad 1.5)
  other vias: 50.11,100.71
N$25  (via drill 0.85 pad 1.5)
  other vias: 52.71,103.21
N$26  (via drill 0.85 pad 1.5)
  other vias: 52.71,100.71
N$27  (via drill 0.85 pad 1.5)
  other vias: 55.21,103.21
N$28  (via drill 0.85 pad 1.5)
  other vias: 55.21,100.71
N$29  (via drill 0.85 pad 1.5)
  other vias: 57.71,103.21
N$30  (via drill 0.85 pad 1.5)
  other vias: 57.71,100.71
N$31  (via drill 0.85 pad 1.5)
  other vias: 60.21,103.21
N$32  (via drill 0.85 pad 1.5)
  other vias: 60.21,100.71
N$33  (via drill 0.85 pad 1.5)
  other vias: 62.81,103.21
N$34  (via drill 0.85 pad 1.5)
  other vias: 62.81,100.71
N$35  (via drill 0.85 pad 1.5)
  other vias: 65.31,103.21
N$36  (via drill 0.85 pad 1.5)
  other vias: 65.31,100.61
N$37  (via drill 0.85 pad 1.5)
  other vias: 67.91,103.21
N$38  (via drill 0.85 pad 1.5)
  other vias: 67.81,100.71
N$39  (via drill 0.85 pad 1.5)
  other vias: 70.51,103.21
N$40  (via drill 0.85 pad 1.5)
  other vias: 70.41,100.71
N$41  (via drill 0.85 pad 1.5)
  other vias: 73.01,103.21
N$42  (via drill 0.85 pad 1.5)
  other vias: 73.01,100.71
N$43  (via drill 0.85 pad 1.5)
  other vias: 75.61,103.31
N$44  (via drill 0.85 pad 1.5)
  other vias: 75.41,100.71
N$45  (via drill 0.85 pad 1.5)
  other vias: 6.51,194.11
N$46  (via drill 0.85 pad 1.5)
  other vias: 6.51,191.51
N$47  (via drill 0.85 pad 1.5)
  other vias: 8.91,191.51
N$48  (via drill 0.85 pad 1.5)
  other vias: 9.01,194.11
N$49  (via drill 0.85 pad 1.5)
  other vias: 11.51,194.11
N$50  (via drill 0.85 pad 1.5)
  other vias: 14.11,194.11
N$51  (via drill 0.85 pad 1.5)
  other vias: 16.61,194.11
N$52  (via drill 0.85 pad 1.5)
  other vias: 19.11,194.11
N$53  (via drill 0.85 pad 1.5)
  other vias: 21.61,194.11
N$54  (via drill 0.85 pad 1.5)
  other vias: 24.21,194.01
N$55  (via drill 0.85 pad 1.5)
  other vias: 24.21,191.61
N$56  (via drill 0.85 pad 1.5)
  other vias: 21.71,191.61
N$57  (via drill 0.85 pad 1.5)
  other vias: 19.21,191.61
N$58  (via drill 0.85 pad 1.5)
  other vias: 16.71,191.51
N$59  (via drill 0.85 pad 1.5)
  other vias: 14.11,191.61
N$60  (via drill 0.85 pad 1.5)
  other vias: 11.61,191.61
N$61  (via drill 0.85 pad 1.5)
  other vias: 90.43,192.35
N$62  (via drill 0.85 pad 1.5)
  other vias: 92.95,192.33
N$63  (via drill 0.85 pad 1.5)
  other vias: 90.45,189.79
N$64  (via drill 0.85 pad 1.5)
  other vias: 92.96,189.79
N$65  (via drill 0.85 pad 1.5)
  other vias: 90.42,187.26
N$66  (via drill 0.85 pad 1.5)
  other vias: 92.98,187.25
N$67  (via drill 0.85 pad 1.5)
  other vias: 90.43,184.72
N$68  (via drill 0.85 pad 1.5)
  other vias: 92.96,184.74
N$69  (via drill 0.85 pad 1.5)
  other vias: 90.4,182.16
N$70  (via drill 0.85 pad 1.5)
  other vias: 92.94,182.17
N$71  (via drill 0.85 pad 1.5)
  other vias: 90.42,179.64
N$72  (via drill 0.85 pad 1.5)
  other vias: 92.95,179.64
N$73  (via drill 0.85 pad 1.5)
  other vias: 90.41,177.09
N$74  (via drill 0.85 pad 1.5)
  other vias: 92.96,177.08
N$75  (via drill 0.85 pad 1.5)
  other vias: 90.41,174.51
N$76  (via drill 0.85 pad 1.5)
  other vias: 92.98,174.55
N$77  (via drill 1.3 pad 1.3)
  other vias: 28.21,119.35
N$78  (via drill 1.3)
  other vias: 19.62,107.97
N$79
  Bottom 0.813: 71.59,53.53 C1.+ 63.42,53.55 C4.1 53.61,53.46 | X6.2 77.51,57.3 73.77,61.04 C2.+ 68.25,61.04 66.73,59.52 C3.1 57.07,59.52 52.75,55.2 52.75,54.41 | U$1.IN+ 52.73,24.59 50.68,24.59 49.31,25.97 49.31,30.81 49.31,31.71 49.31,34.61 52.86,38.16 U$2.IN+ 52.75,46.82 52.75,52.6 | 52.75,54.41 52.75,53.41 | 52.75,53.41 52.75,52.6 | 52.75,53.41 52.8,53.46 53.61,53.46 | 52.75,54.41 53.61,53.55 53.61,53.46 | 52.75,52.6 53.61,53.46
N$81  (via drill 1.3 pad 1.3)
  other vias: 22.11,96.98
N$82  (via drill 1.3 pad 1.5)
  other vias: 19.66,97.04
N$83  (via drill 1.3 pad 1.5)
  other vias: 13.14,95.27
N$84  (via drill 1.3 pad 1.5)
  other vias: 15.7,95.31
N$85  (via drill 1.3 pad 1.3)
  other vias: 13.36,104.28
N$86  (via drill 1.3 pad 1.3)
  other vias: 15.84,104.32
N$91  (via drill 1.3 pad 1.3)
  other vias: 90.42,192.32
N$92  (via drill 1.3 pad 1.3)
  other vias: 92.97,192.32
N$93  (via drill 1.3 pad 1.3)
  other vias: 92.95,189.77
N$94  (via drill 1.3 pad 1.3)
  other vias: 90.45,189.82
N$95  (via drill 1.3 pad 1.3)
  other vias: 92.97,187.24
N$96  (via drill 1.3 pad 1.3)
  other vias: 90.45,187.24
N$97  (via drill 1.3 pad 1.3)
  other vias: 92.97,184.69
N$98  (via drill 1.3 pad 1.3)
  other vias: 90.45,184.69
N$99  (via drill 1.3 pad 1.3)
  other vias: 90.45,182.17
N$100  (via drill 1.3 pad 1.3)
  other vias: 92.95,182.19
N$101  (via drill 1.3 pad 1.3)
  other vias: 92.95,179.67
N$102  (via drill 1.3 pad 1.3)
  other vias: 90.4,179.62
N$103  (via drill 1.3 pad 1.3)
  other vias: 92.95,177.07
N$104  (via drill 1.3 pad 1.3)
  other vias: 90.37,177.09
N$105  (via drill 1.3 pad 1.3)
  other vias: 90.38,174.54
N$106  (via drill 1.3 pad 1.3)
  other vias: 92.95,174.54
N$107  (via drill 1.3 pad 1.3)
  other vias: 6.45,194.12
N$108  (via drill 1.3 pad 1.3)
  other vias: 9.01,194.12
N$109  (via drill 1.3 pad 1.3)
  other vias: 11.54,194.12
N$110  (via drill 1.3 pad 1.3)
  other vias: 14.13,194.12
N$111  (via drill 1.3 pad 1.3)
  other vias: 16.62,194.12
N$112  (via drill 1.3 pad 1.3)
  other vias: 19.18,194.08
N$113  (via drill 1.3 pad 1.3)
  other vias: 21.66,194.08
N$114  (via drill 1.3 pad 1.3)
  other vias: 24.22,194.04
N$115  (via drill 1.3 pad 1.3)
  other vias: 24.26,191.56
N$116  (via drill 1.3 pad 1.3)
  other vias: 21.66,191.59
N$117  (via drill 1.3 pad 1.3)
  other vias: 19.22,191.59
N$118  (via drill 1.3 pad 1.3)
  other vias: 16.66,191.52
N$119  (via drill 1.3 pad 1.3)
  other vias: 14.1,191.59
N$120  (via drill 1.3 pad 1.3)
  other vias: 11.61,191.59
N$121  (via drill 1.3 pad 1.3)
  other vias: 9.01,191.56
N$122  (via drill 1.3 pad 1.3)
  other vias: 6.53,191.48
N$123  (via drill 1.3)
  other vias: 27.84,109.02
N$127  (via drill 1 pad 1.3)
  other vias: 19.66,107.97
N$130  (via drill 1.3 pad 1.5)
  other vias: 32.39,103.15
N$131  (via drill 1.3 pad 1.5)
  other vias: 32.29,100.71
N$132  (via drill 1.3 pad 1.5)
  other vias: 34.92,103.31
N$133  (via drill 1.3 pad 1.5)
  other vias: 34.89,100.73
N$134  (via drill 1.3 pad 1.5)
  other vias: 37.36,103.2
N$135  (via drill 1.3 pad 1.5)
  other vias: 37.39,100.68
N$136  (via drill 1.3 pad 1.5)
  other vias: 39.97,103.26
N$137  (via drill 1.3 pad 1.5)
  other vias: 39.92,100.68
N$138  (via drill 1.3 pad 1.5)
  other vias: 42.49,103.26
N$139  (via drill 1.3 pad 1.5)
  other vias: 42.49,100.78
N$140  (via drill 1.3 pad 1.5)
  other vias: 45.04,103.23
N$141  (via drill 1.3 pad 1.5)
  other vias: 47.58,103.2
N$142  (via drill 1.3 pad 1.5)
  other vias: 50.13,103.22
N$143  (via drill 1.3 pad 1.5)
  other vias: 52.74,103.2
N$144  (via drill 1.3 pad 1.5)
  other vias: 47.59,100.69
N$145  (via drill 1.3 pad 1.5)
  other vias: 50.1,100.69
N$146  (via drill 1.3 pad 1.5)
  other vias: 52.72,100.73
N$147  (via drill 1.3 pad 1.5)
  other vias: 55.17,103.24
N$148  (via drill 1.3 pad 1.5)
  other vias: 55.23,100.71
N$149  (via drill 1.3 pad 1.5)
  other vias: 57.7,103.22
N$150  (via drill 1.3 pad 1.5)
  other vias: 57.68,100.69
N$151  (via drill 1.3 pad 1.5)
  other vias: 60.28,103.24
N$152  (via drill 1.3 pad 1.5)
  other vias: 60.28,100.71
N$153  (via drill 1.3 pad 1.5)
  other vias: 62.79,100.69
N$154  (via drill 1.3 pad 1.5)
  other vias: 62.81,103.24
N$155  (via drill 1.3 pad 1.5)
  other vias: 65.32,103.22
N$156  (via drill 1.3 pad 1.5)
  other vias: 65.35,100.63
N$157  (via drill 1.3 pad 1.5)
  other vias: 67.9,100.75
N$158  (via drill 1.3 pad 1.5)
  other vias: 67.9,103.24
N$159  (via drill 1.3 pad 1.5)
  other vias: 70.45,103.24
N$160  (via drill 1.3 pad 1.5)
  other vias: 70.41,100.67
N$161  (via drill 1.3 pad 1.5)
  other vias: 75.59,103.31
N$162  (via drill 1.3 pad 1.5)
  other vias: 75.48,100.63
N$163  (via drill 1.3 pad 1.5)
  other vias: 72.99,100.71
N$164  (via drill 1.3 pad 1.5)
  other vias: 73.01,103.2
PB1
  Bottom 0.406: X4.1 28.6,164.52 29.86,163.26 29.86,132.46 30.81,131.51 39.11,131.51 39.96,130.66 IC1.53 40.11,103.41
PB2
  Bottom 0.406: X4.2 27.88,159.44 28.51,158.81 28.51,131.21 29.41,130.31 36.21,130.31 37.42,129.1 IC1.51
PB3
  Bottom 0.406: X4.3 26.36,154.36 27.11,153.61 27.11,129.41 27.86,128.66 IC1.30
PB4
  Bottom 0.406: X4.4 24.64,149.28 25.61,148.31 25.61,126.91 26.4,126.12 IC1.29
PB5
  Bottom 0.406: X4.5 23.32,144.2 24.11,143.41 24.11,124.41 24.94,123.58 IC1.28
PB6
  Bottom 0.406: X4.6 21.95,139.12 22.51,138.56 22.51,121.91 23.38,121.04 IC1.27
PB7  (via drill 0.8 pad 1.5, 1 pad 1.3)  (1 unrouted)
  Top 0.406: v28.27,119.37 28.27,109.28
  Bottom 0.406: X4.7 20.2,134.04 20.81,133.43 20.81,120.41 21.88,119.34 28.24,119.34 v28.27,119.37 | IC1.50 34.88,98.67 34.31,98.1 29.97,98.1 29.41,98.66 29.41,102.41 27.83,103.99 27.83,108.04 27.84,108.05 v27.84,108.93 27.84,108.95
RESET
  Bottom 0.406: IC1.1 89.67,164.21 90.42,164.96 X7.1
RX  (via drill 0.8 pad 1.5, 1.3)
  Top 0.406: v22.06,107.96 22.06,97.02 v22.11,96.97
  Bottom 0.406: IC1.25 22.51,115.96 22.06,115.51 v22.06,108 v22.06,107.96 | v22.11,96.97 22.13,96.95 22.13,91.48 22.94,90.67 60.99,90.67 62.35,89.31 62.35,64.3 61.1,63.05 31.67,63.05 30.18,61.56 BOARD1.D17
SCL  (via drill 0.8 pad 1.5)
  Top 0.406: v15.87,104.31 15.71,104.15 v15.71,95.31
  Bottom 0.406: IC1.23 32.24,110.78 26.51,110.78 26.11,110.38 26.11,105.01 25.41,104.31 v15.87,104.31 | v15.71,95.31 15.74,95.28 15.74,92.64 14.73,91.63 8.16,91.63 7.31,90.78 7.31,20.71 7.83,20.19 X3.4 17.6,20.19 U$3.SCL1 | v15.87,104.31
SDA  (via drill 0.8 pad 1.5)
  Top 0.406: v13.31,104.31 13.15,104.15 v13.15,95.27
  Bottom 0.406: X3.3 11.75,15.19 13.92,17.36 U$3.SDA1 | v13.31,104.31 13.41,104.41 13.41,105.41 13.91,105.91 23.71,105.91 24.31,106.51 24.31,112.91 24.82,113.42 IC1.24 | X3.3 8.33,15.29 | v13.15,95.27 13.13,95.25 13.13,93.69 12.46,93.02 6.92,93.02 5.97,92.07 5.97,15.8 6.58,15.19 X3.3
TX  (via drill 0.8 pad 1.5)  (1 unrouted)
  Top 0.406: 19.68,107.96 19.67,107.95 v19.67,97.02
  Bottom 0.406: IC1.26 31.54,117.7 20.7,117.7 19.68,116.68 19.68,107.96 | v19.67,97.02 19.67,90.51 21.02,89.16 58.71,89.16 60.07,87.8 L6.1

### Text on the board
Bottom: TUMARANG | SMART / GARDEN | EIND - KATAPANG
tPlace: PB1 | PB2 | PB3 | PB4 | IN RELAY | PB5 | BUTTON CONTROL | GND | PB6 | 5V | PB7 | SOIL SENSOR | DATA | GND | GND | 5V | SENSOR SUHU | DATA | GND | R4.7K | IN1 | IN2 | RELAY | IN3 | IN4 | 5V | ARDUINO MEGA | R470 | BASAH | POMPA | 7V | GND | R470 | LEMBAB | 12V | R470 | INDIKATOR | KERING | R2K | R470 | SUPPLY | 1000uF | 100nF | VCC | 100nF | 470uF | GND | POWER | 12V | SISTEM PENYIRAM | TANAMAN OTOMATIS | SCL | 7V | SDA | LCD I2C | 5V | GND | DC TO DC STEP-DOWN